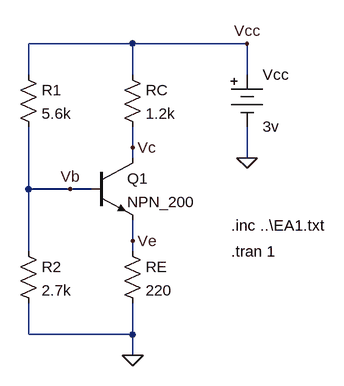
[diagram p0: schematic Pol.asc]
Pol.asc, the LTspice schematic file:
Version 4
SHEET 1 880 680
WIRE 16 -112 -144 -112
WIRE 192 -112 16 -112
WIRE -144 -64 -144 -112
WIRE 16 -64 16 -112
WIRE 192 -64 192 -112
WIRE 16 48 16 16
WIRE 16 64 16 48
WIRE 192 64 192 16
WIRE -144 112 -144 16
WIRE -80 112 -144 112
WIRE -48 112 -80 112
WIRE 16 192 16 160
WIRE -144 208 -144 112
WIRE 16 208 16 192
WIRE -144 336 -144 288
WIRE 16 336 16 288
WIRE 16 336 -144 336
WIRE 16 368 16 336
FLAG 16 368 0
FLAG 192 64 0
FLAG 16 48 Vc
FLAG -80 112 Vb
FLAG 16 192 Ve
FLAG 192 -112 Vcc
SYMBOL npn -48 64 R0
SYMATTR InstName Q1
SYMATTR Value NPN_200
SYMBOL res 0 -80 R0
SYMATTR InstName RC
SYMATTR Value 1.2k
SYMBOL res -160 -80 R0
SYMATTR InstName R1
SYMATTR Value 5.6k
SYMBOL res 0 192 R0
SYMATTR InstName RE
SYMATTR Value 220
SYMBOL Misc\\battery 192 -80 R0
WINDOW 123 0 0 Left 0
WINDOW 39 0 0 Left 0
SYMATTR InstName Vcc
SYMATTR Value 3v
SYMBOL res -160 192 R0
SYMATTR InstName R2
SYMATTR Value 2.7k
TEXT 168 168 Left 2 !.inc ..\\EA1.txt
TEXT 168 208 Left 2 !.tran 1

The netlist it stands for:
* Pol.asc
Q1 Vc Vb Ve 0 NPN_200
RC Vcc Vc 1.2k
R1 Vcc Vb 5.6k
RE Ve 0 220
Vcc Vcc 0 3v
R2 Vb 0 2.7k
.model NPN NPN
.model PNP PNP
.lib standard.bjt
.inc ..\EA1.txt
.tran 1
.backanno
.end